# EAGLE design CoProcessor (EAGLE 9.2.2)

## Sheet 1 of 3: Connectors
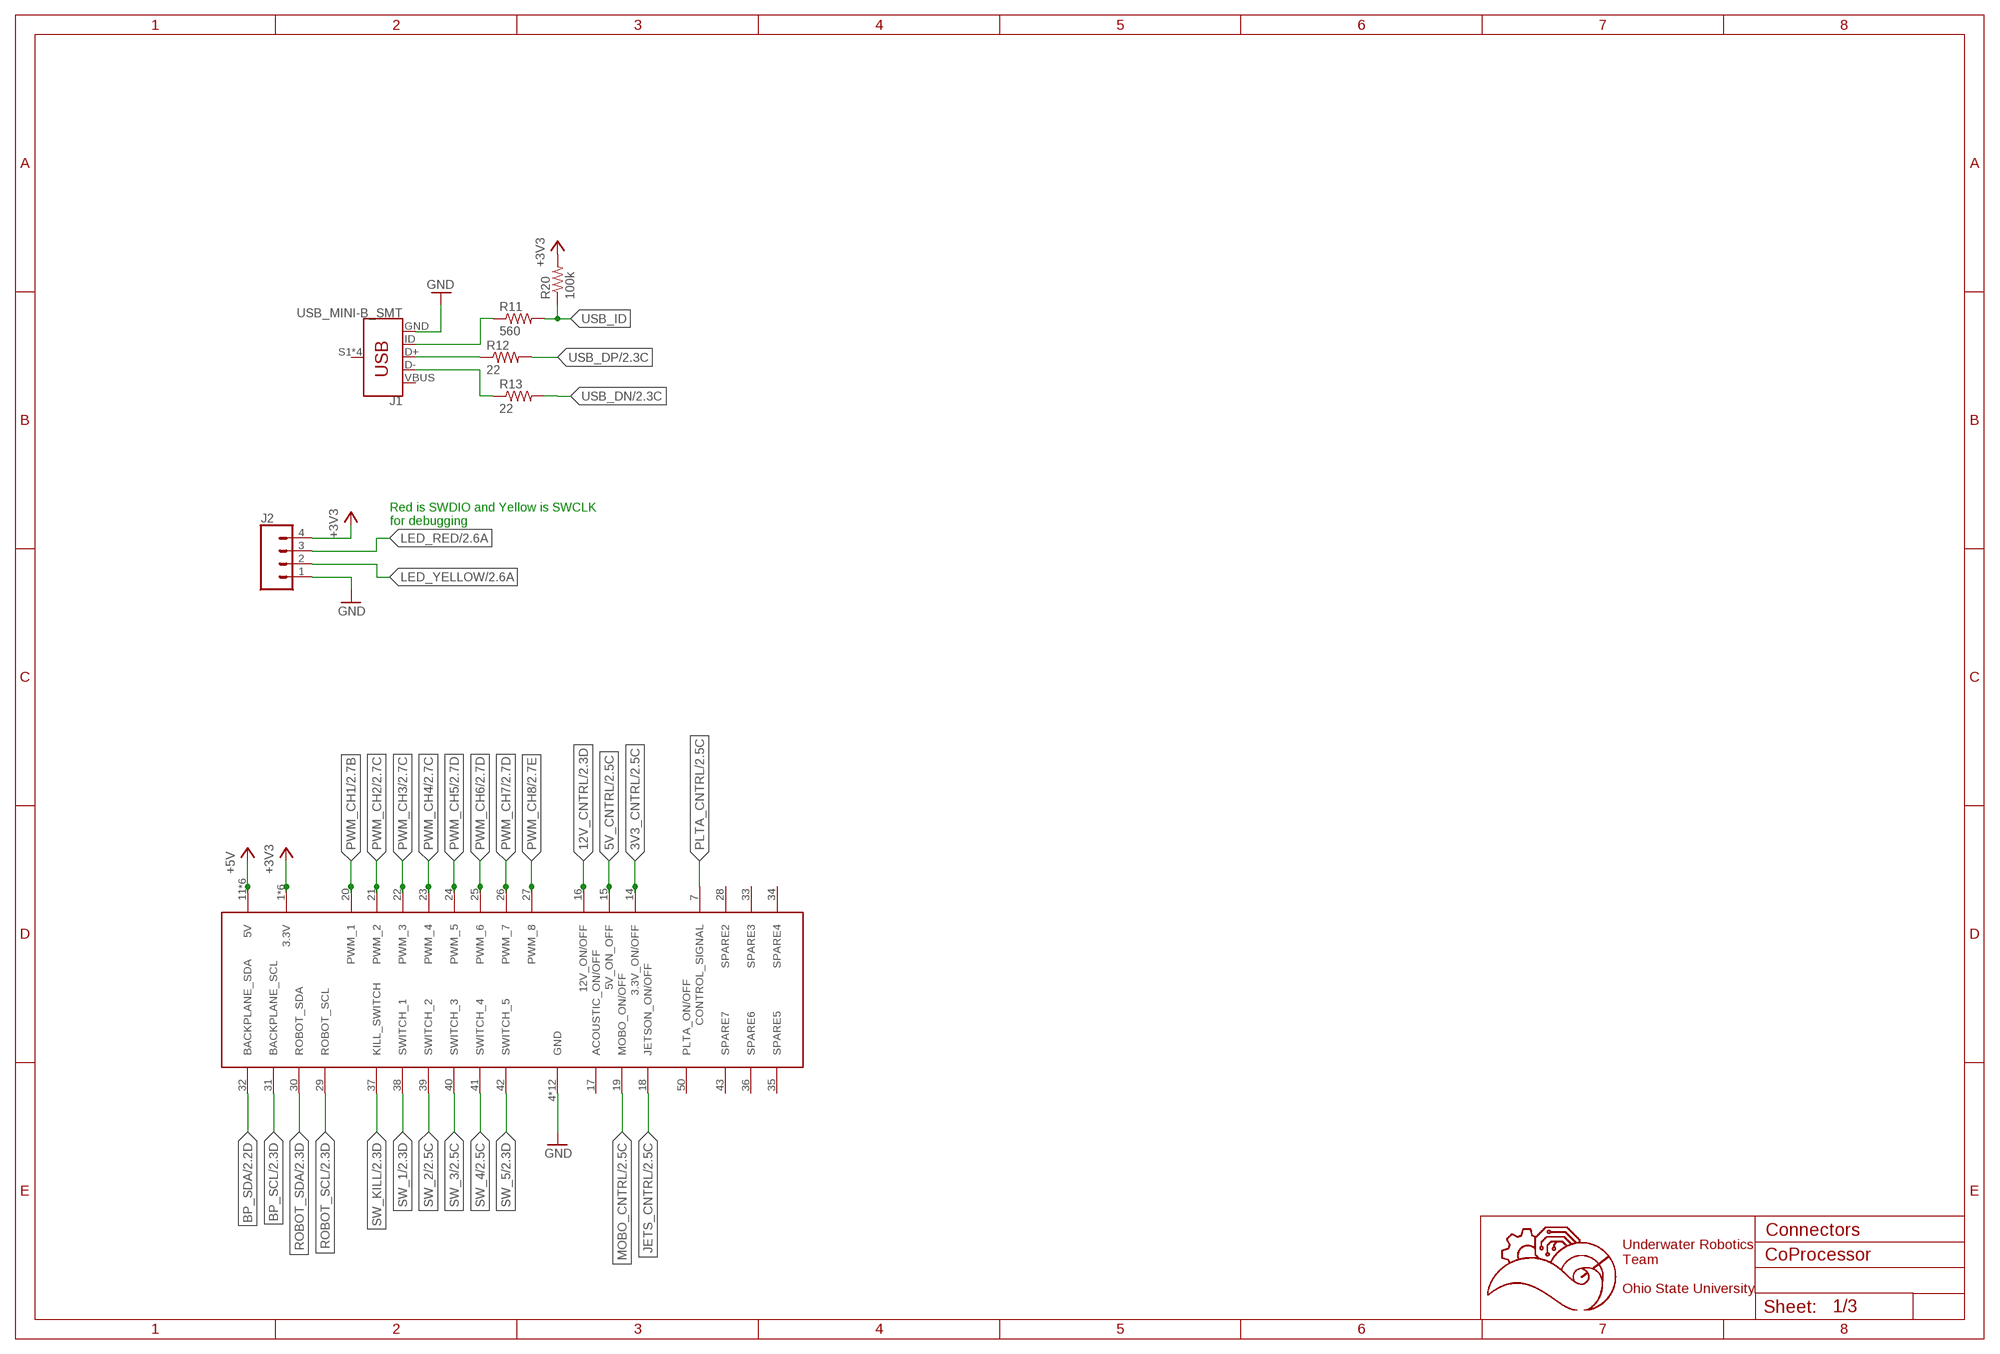
[diagram p0: schematic, sheet 1]

### Parts
J1  USB_MINI-B_SMT  [USB-MINIB]
J2  CONN_04  [1X04]
R11  560  R-US_R0603  [R0603]
R12  22  R-US_R0603  [R0603]
R13  22  R-US_R0603  [R0603]
R20  100k  R-US_R0603  [R0603]
U$1  5530843-EDGE  [5530843-6-BOARDFINGERS]

### Nets
3V3_CNTRL: U$1.14(3.3V_ON/OFF) ; also sheet 2
5V_CNTRL: U$1.15(5V_ON_OFF) ; also sheet 2
12V_CNTRL: U$1.16(12V_ON/OFF) ; also sheet 2
+3V3: J2.4 R20.2 U$1.1(3.3V) U$1.2(3.3V) U$1.3(3.3V) U$1.54(3.3V) U$1.55(3.3V) U$1.56(3.3V) ; also sheet 2,3
+5V: U$1.11(5V) U$1.12(5V) U$1.13(5V) U$1.44(5V) U$1.45(5V) U$1.46(5V)
BP_SCL: U$1.31(BACKPLANE_SCL) ; also sheet 2
BP_SDA: U$1.32(BACKPLANE_SDA) ; also sheet 2
GND: J1.GND J2.1 U$1.4(GND) U$1.5(GND) U$1.6(GND) U$1.8(GND) U$1.9(GND) U$1.10(GND) U$1.47(GND) U$1.48(GND) U$1.49(GND) U$1.51(GND) U$1.52(GND) U$1.53(GND) ; also sheet 2,3
JETS_CNTRL: U$1.18(JETSON_ON/OFF) ; also sheet 2
LED_RED: J2.3 ; also sheet 2
LED_YELLOW: J2.2 ; also sheet 2
MOBO_CNTRL: U$1.19(MOBO_ON/OFF) ; also sheet 2
N$2: J1.ID R11.1
N$4: J1.D+ R12.1
N$5: J1.D- R13.1
PLTA_CNTRL: U$1.7(CONTROL_SIGNAL) ; also sheet 2
PWM_CH1: U$1.20(PWM_1) ; also sheet 2
PWM_CH2: U$1.21(PWM_2) ; also sheet 2
PWM_CH3: U$1.22(PWM_3) ; also sheet 2
PWM_CH4: U$1.23(PWM_4) ; also sheet 2
PWM_CH5: U$1.24(PWM_5) ; also sheet 2
PWM_CH6: U$1.25(PWM_6) ; also sheet 2
PWM_CH7: U$1.26(PWM_7) ; also sheet 2
PWM_CH8: U$1.27(PWM_8) ; also sheet 2
ROBOT_SCL: U$1.29(ROBOT_SCL) ; also sheet 2
ROBOT_SDA: U$1.30(ROBOT_SDA) ; also sheet 2
SW_1: U$1.38(SWITCH_1) ; also sheet 2
SW_2: U$1.39(SWITCH_2) ; also sheet 2
SW_3: U$1.40(SWITCH_3) ; also sheet 2
SW_4: U$1.41(SWITCH_4) ; also sheet 2
SW_5: U$1.42(SWITCH_5) ; also sheet 2
SW_KILL: U$1.37(KILL_SWITCH) ; also sheet 2
USB_DN: R13.2 ; also sheet 2
USB_DP: R12.2 ; also sheet 2
USB_ID: R11.2 R20.1
Unconnected: J1.S1(SHIELD) J1.S2(SHIELD) J1.S3(SHIELD) J1.S4(SHIELD) U$1.17(ACOUSTIC_ON/OFF) U$1.28(SPARE2) U$1.33(SPARE3) U$1.34(SPARE4) U$1.35(SPARE5) U$1.36(SPARE6) U$1.43(SPARE7) U$1.50(PLTA_ON/OFF)

### Notes on the sheet
- Red is SWDIO and Yellow is SWCLK
  for debugging
- Connectors
- Underwater Robotics
  Team
  
  Ohio State University

## Sheet 2 of 3: MCU
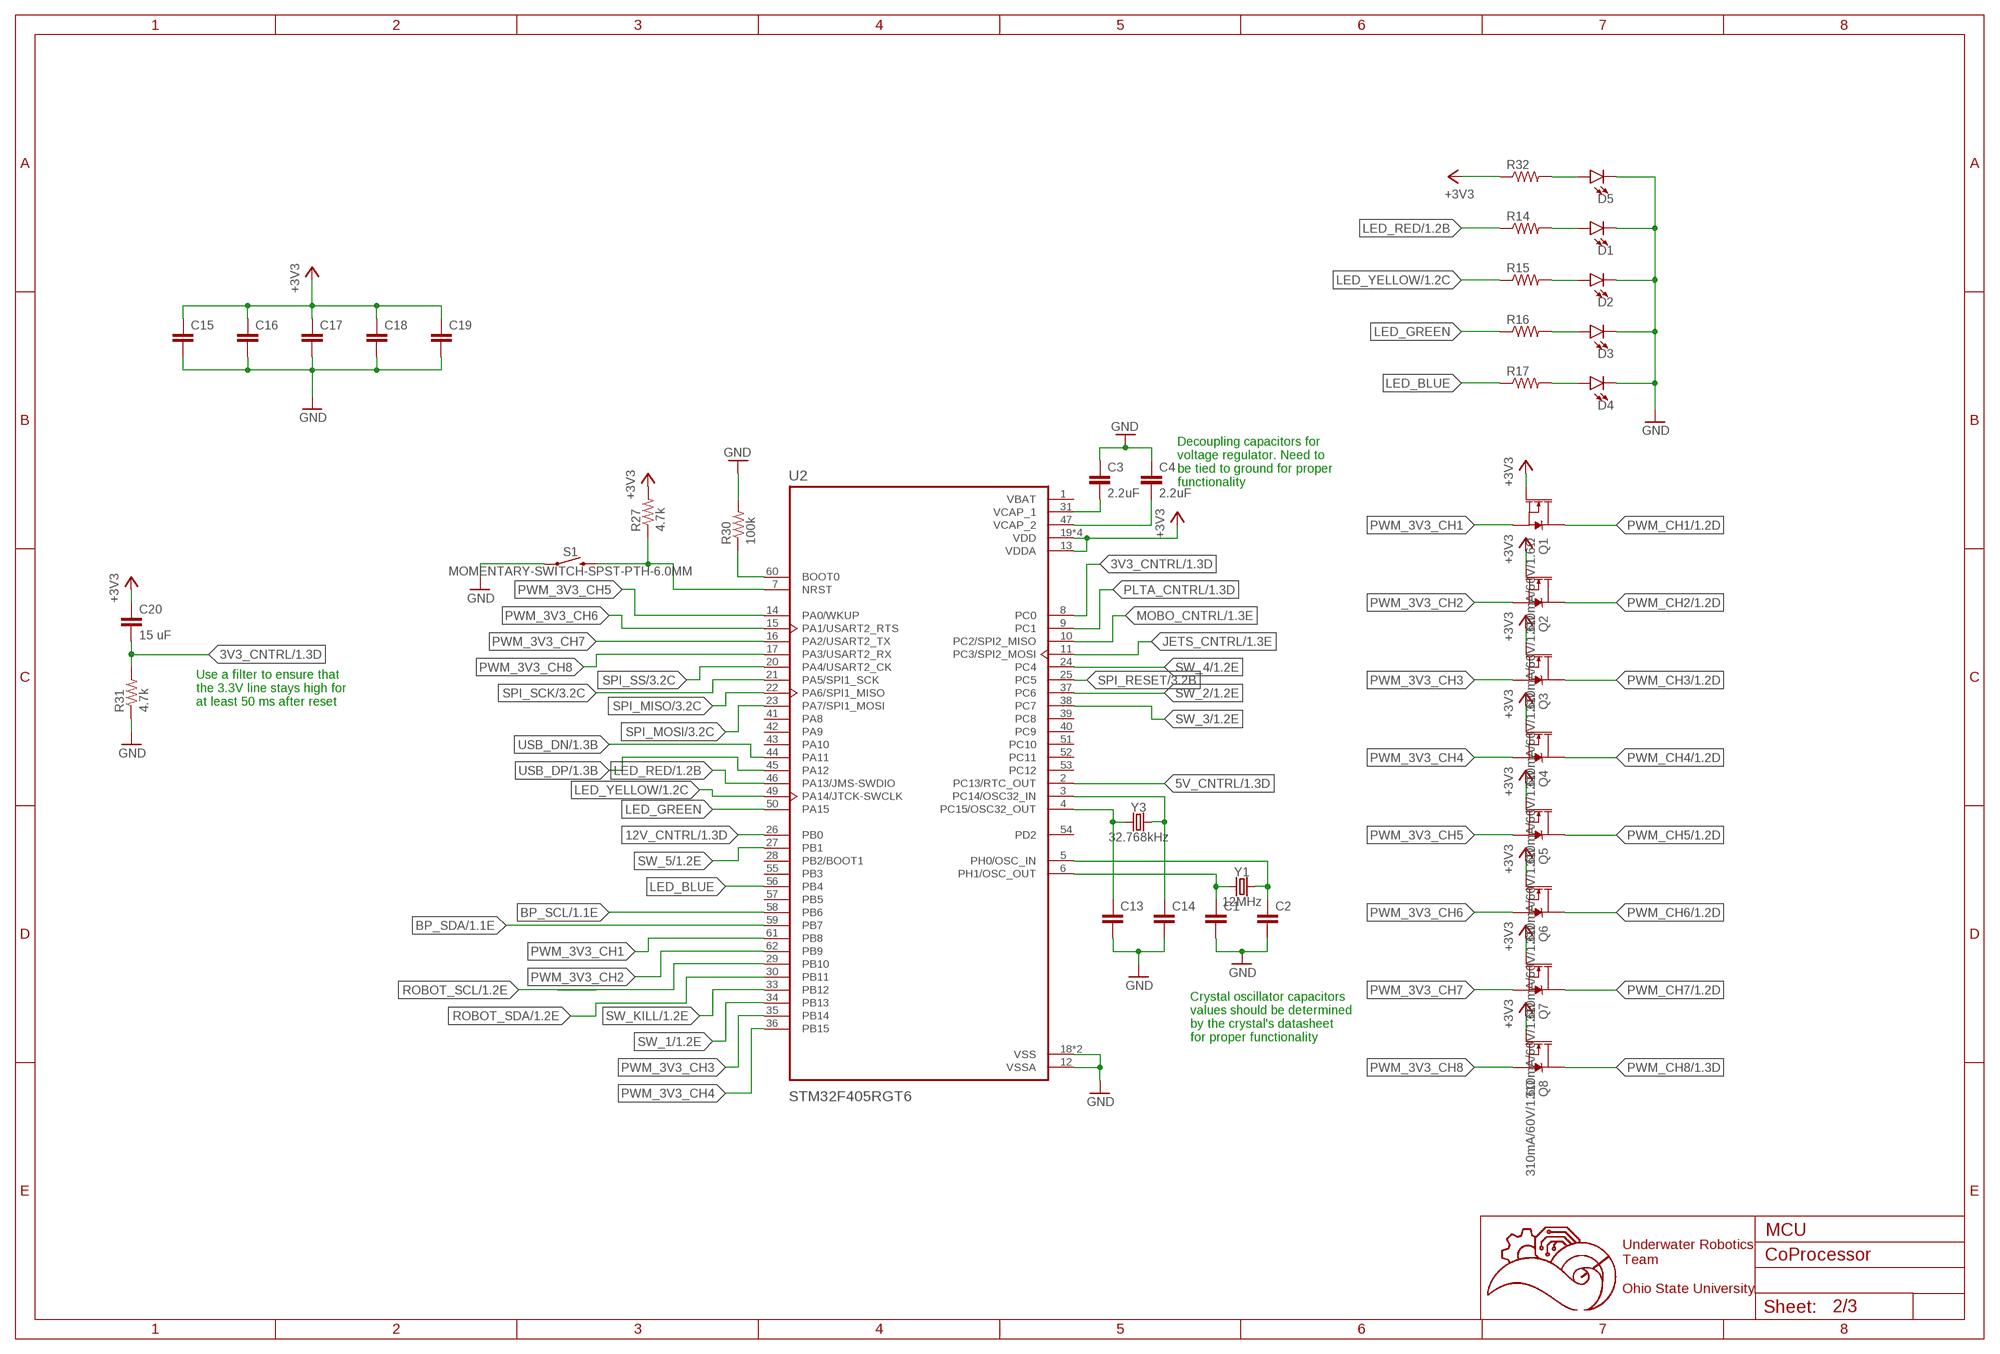
[diagram p1: schematic, sheet 2]

### Parts
C1  C-EUC0603  [C0603]
C2  C-EUC0603  [C0603]
C3  2.2uF  C-EUC0603  [C0603]
C4  2.2uF  C-EUC0603  [C0603]
C13  C-EUC0603  [C0603]
C14  C-EUC0603  [C0603]
C15  C-EUC0603  [C0603]
C16  C-EUC0603  [C0603]
C17  C-EUC0603  [C0603]
C18  C-EUC0603  [C0603]
C19  C-EUC0603  [C0603]
C20  15 uF  C-EU050-025X075  [C050-025X075]
D1  LED0603  [LED-0603]
D2  LED0603  [LED-0603]
D3  LED0603  [LED-0603]
D4  LED0603  [LED-0603]
D5  LED0603  [LED-0603]
Q1  310mA/60V/1.6Ω  MOSFET-NCH-2N7002PW  [SOT323]
Q2  310mA/60V/1.6Ω  MOSFET-NCH-2N7002PW  [SOT323]
Q3  310mA/60V/1.6Ω  MOSFET-NCH-2N7002PW  [SOT323]
Q4  310mA/60V/1.6Ω  MOSFET-NCH-2N7002PW  [SOT323]
Q5  310mA/60V/1.6Ω  MOSFET-NCH-2N7002PW  [SOT323]
Q6  310mA/60V/1.6Ω  MOSFET-NCH-2N7002PW  [SOT323]
Q7  310mA/60V/1.6Ω  MOSFET-NCH-2N7002PW  [SOT323]
Q8  310mA/60V/1.6Ω  MOSFET-NCH-2N7002PW  [SOT323]
R14  R-US_R0603  [R0603]
R15  R-US_R0603  [R0603]
R16  R-US_R0603  [R0603]
R17  R-US_R0603  [R0603]
R27  4.7k  R-US_R0603  [R0603]
R30  100k  R-US_R0603  [R0603]
R31  4.7k  R-US_R0603  [R0603]
R32  R-US_R0603  [R0603]
S1  MOMENTARY-SWITCH-SPST-PTH-6.0MM  [TACTILE_SWITCH_PTH_6.0MM]
U2  STM32F405RGT6  [QFP50P1200X1200X160-64N]
Y1  12MHz  CRYSTAL-16MHZPTH-HC49US  [HC49US]
Y3  32.768kHz  CRYSTAL-32.768KHZSMD-3.2X1.5  [CRYSTAL-SMD-3.2X1.5MM]

### Nets
3V3_CNTRL: C20.2 R31.2 U2.8(PC0) ; also sheet 1
5V_CNTRL: U2.2(PC13/RTC_OUT) ; also sheet 1
12V_CNTRL: U2.26(PB0) ; also sheet 1
+3V3: C15.1 C16.1 C17.1 C18.1 C19.1 C20.1 Q1.1(G) Q2.1(G) Q3.1(G) Q4.1(G) Q5.1(G) Q6.1(G) Q7.1(G) Q8.1(G) R27.2 R32.1 U2.13(VDDA) U2.19(VDD) U2.32(VDD) U2.48(VDD) U2.64(VDD) ; also sheet 1,3
BP_SCL: U2.58(PB6) ; also sheet 1
BP_SDA: U2.59(PB7) ; also sheet 1
GND: C1.2 C2.2 C3.1 C4.1 C13.2 C14.2 C15.2 C16.2 C17.2 C18.2 C19.2 D1.C D2.C D3.C D4.C D5.C R30.2 R31.1 S1.1 U2.12(VSSA) U2.18(VSS) U2.63(VSS) ; also sheet 1,3
JETS_CNTRL: U2.11(PC3/SPI2_MOSI) ; also sheet 1
LED_BLUE: R17.1 U2.56(PB4)
LED_GREEN: R16.1 U2.50(PA15)
LED_RED: R14.1 U2.46(PA13/JMS-SWDIO) ; also sheet 1
LED_YELLOW: R15.1 U2.49(PA14/JTCK-SWCLK) ; also sheet 1
MOBO_CNTRL: U2.10(PC2/SPI2_MISO) ; also sheet 1
N$1: C1.1 U2.6(PH1/OSC_OUT) Y1.1
N$3: D1.A R14.2
N$6: D2.A R15.2
N$7: D3.A R16.2
N$8: D4.A R17.2
N$9: C2.1 U2.5(PH0/OSC_IN) Y1.2
N$10: C4.2 U2.47(VCAP_2)
N$11: C3.2 U2.31(VCAP_1)
N$15: C13.1 U2.4(PC15/OSC32_OUT) Y3.P$1
N$29: C14.1 U2.3(PC14/OSC32_IN) Y3.P$2
N$30: R30.1 U2.60(BOOT0)
N$31: D5.A R32.2
N$34: R27.1 S1.3 U2.7(NRST)
PLTA_CNTRL: U2.9(PC1) ; also sheet 1
PWM_3V3_CH1: Q1.2(S) U2.61(PB8)
PWM_3V3_CH2: Q2.2(S) U2.62(PB9)
PWM_3V3_CH3: Q3.2(S) U2.35(PB14)
PWM_3V3_CH4: Q4.2(S) U2.36(PB15)
PWM_3V3_CH5: Q5.2(S) U2.14(PA0/WKUP)
PWM_3V3_CH6: Q6.2(S) U2.15(PA1/USART2_RTS)
PWM_3V3_CH7: Q7.2(S) U2.16(PA2/USART2_TX)
PWM_3V3_CH8: Q8.2(S) U2.17(PA3/USART2_RX)
PWM_CH1: Q1.3(D) ; also sheet 1
PWM_CH2: Q2.3(D) ; also sheet 1
PWM_CH3: Q3.3(D) ; also sheet 1
PWM_CH4: Q4.3(D) ; also sheet 1
PWM_CH5: Q5.3(D) ; also sheet 1
PWM_CH6: Q6.3(D) ; also sheet 1
PWM_CH7: Q7.3(D) ; also sheet 1
PWM_CH8: Q8.3(D) ; also sheet 1
ROBOT_SCL: U2.29(PB10) ; also sheet 1
ROBOT_SDA: U2.30(PB11) ; also sheet 1
SPI_MISO: U2.22(PA6/SPI1_MISO) ; also sheet 3
SPI_MOSI: U2.23(PA7/SPI1_MOSI) ; also sheet 3
SPI_RESET: U2.25(PC5) ; also sheet 3
SPI_SCK: U2.21(PA5/SPI1_SCK) ; also sheet 3
SPI_SS: U2.20(PA4/USART2_CK) ; also sheet 3
SW_1: U2.34(PB13) ; also sheet 1
SW_2: U2.37(PC6) ; also sheet 1
SW_3: U2.38(PC7) ; also sheet 1
SW_4: U2.24(PC4) ; also sheet 1
SW_5: U2.27(PB1) ; also sheet 1
SW_KILL: U2.33(PB12) ; also sheet 1
USB_DN: U2.44(PA11) ; also sheet 1
USB_DP: U2.45(PA12) ; also sheet 1
Unconnected: U2.28(PB2/BOOT1) U2.39(PC8) U2.40(PC9) U2.41(PA8) U2.42(PA9) U2.43(PA10) U2.51(PC10) U2.52(PC11) U2.53(PC12) U2.54(PD2) U2.55(PB3) U2.57(PB5)

### Notes on the sheet
- Decoupling capacitors for 
  voltage regulator. Need to
  be tied to ground for proper
  functionality
- Use a filter to ensure that
  the 3.3V line stays high for
  at least 50 ms after reset
- Crystal oscillator capacitors
  values should be determined
  by the crystal's datasheet
  for proper functionality
- MCU
- Underwater Robotics
  Team
  
  Ohio State University

## Sheet 3 of 3: Ethernet
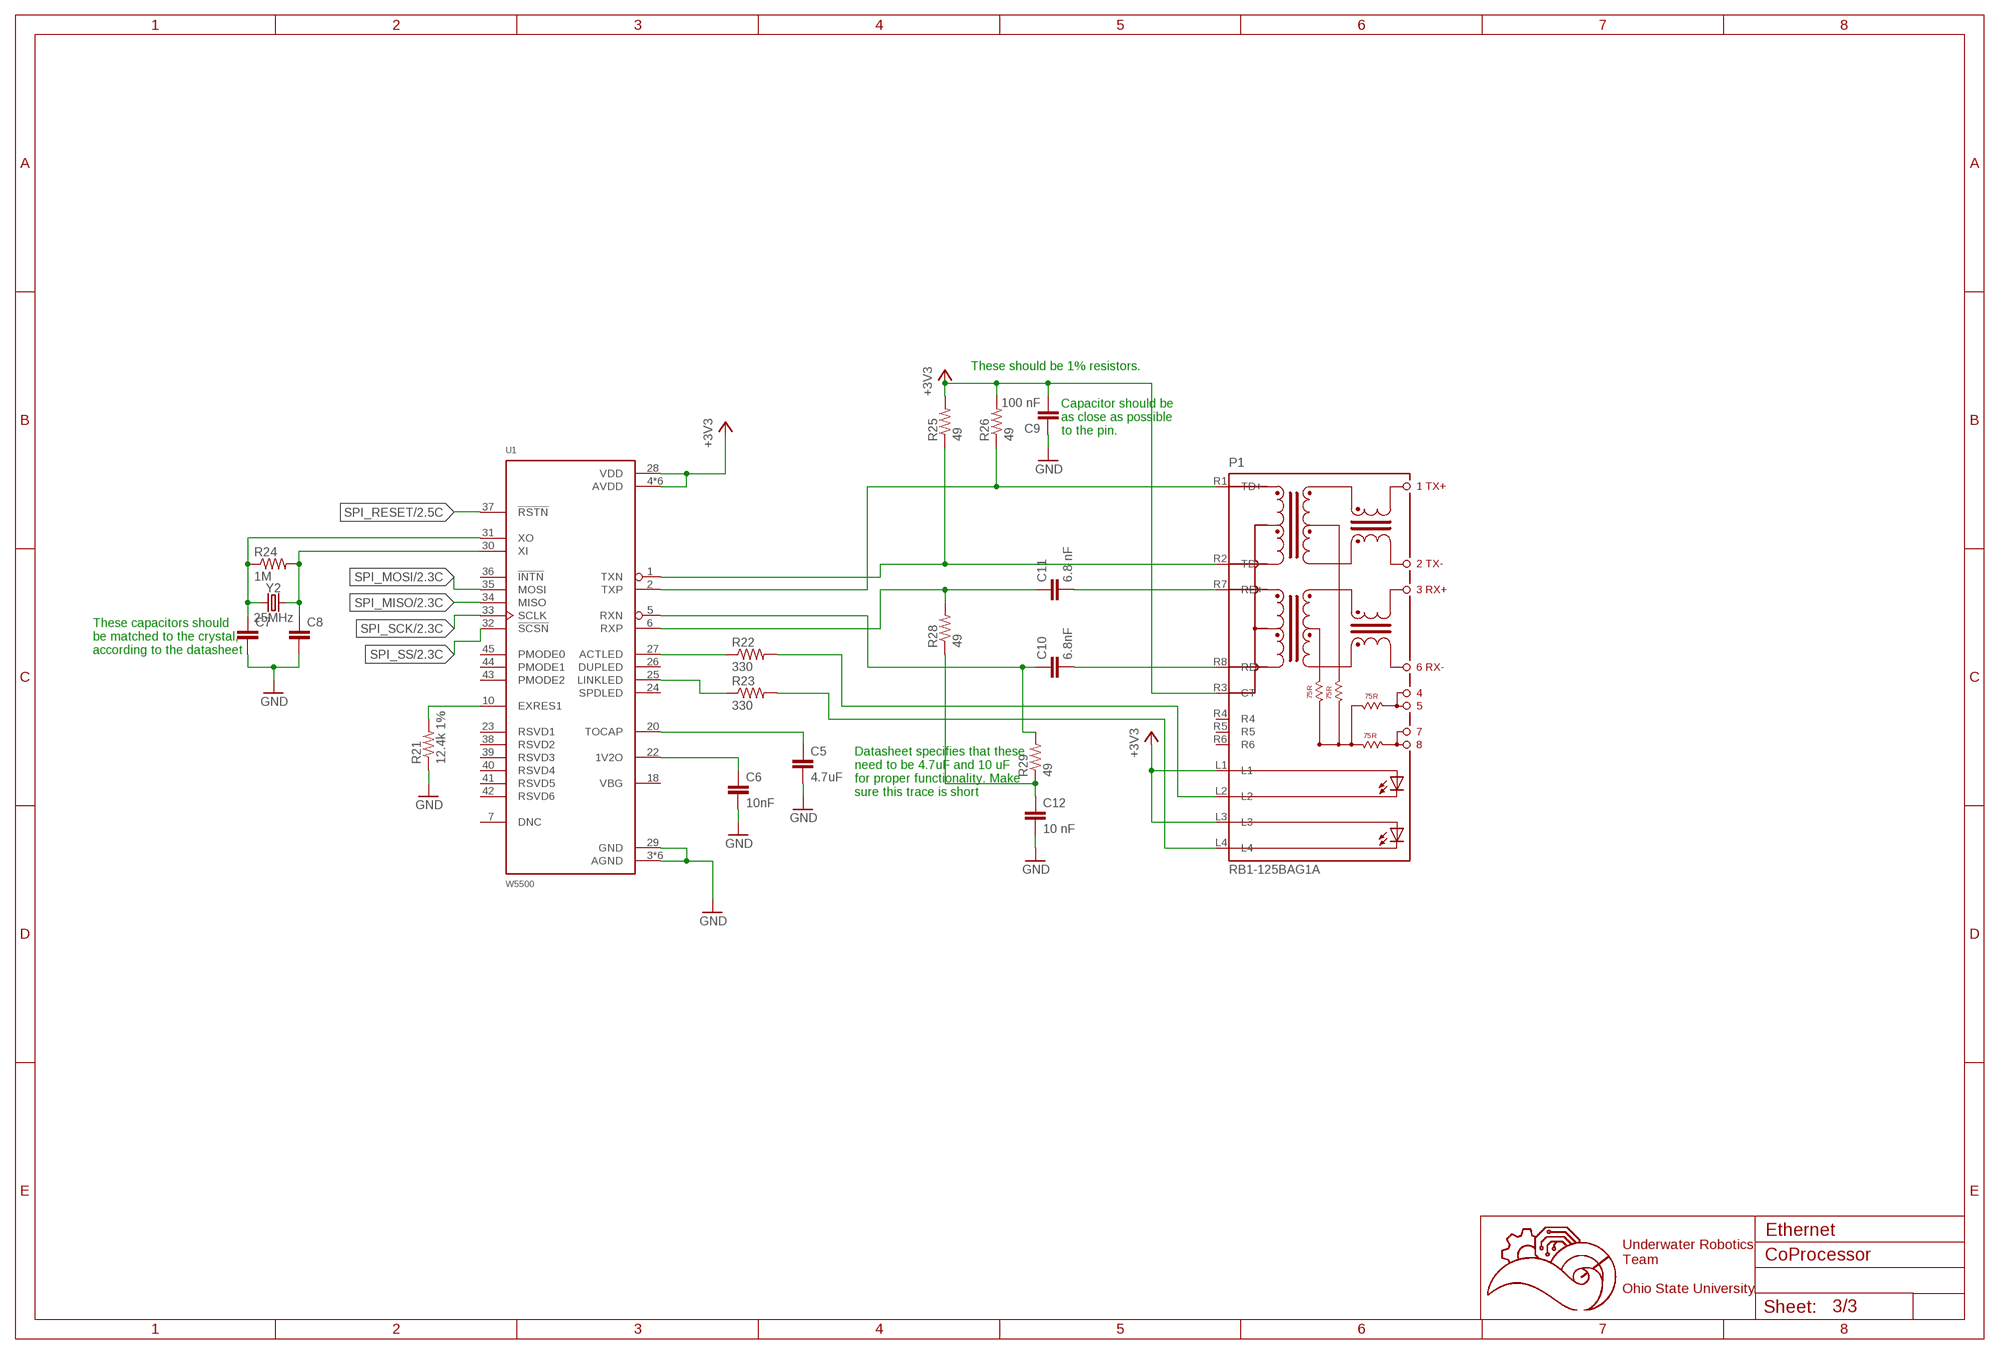
[diagram p2: schematic, sheet 3]

### Parts
C5  4.7uF  C-EUC0603  [C0603]
C6  10nF  C-EUC0603  [C0603]
C7  C-EUC0603  [C0603]
C8  C-EUC0603  [C0603]
C9  100 nF  C-EUC0603  [C0603]
C10  6.8nF  C-EUC0603  [C0603]
C11  6.8 nF  C-EUC0603  [C0603]
C12  10 nF  C-EUC0603  [C0603]
P1  RB1-125BAG1A  [WIZNET_RB1-125BAG1A]
R21  12.4k 1%  R-US_R0603  [R0603]
R22  330  R-US_R0603  [R0603]
R23  330  R-US_R0603  [R0603]
R24  1M  R-US_R0603  [R0603]
R25  49  R-US_R0603  [R0603]
R26  49  R-US_R0603  [R0603]
R28  49  R-US_R0603  [R0603]
R29  49  R-US_R0603  [R0603]
U1  W5500  [QFP50P900X900X160-48N]
Y2  25MHz  CRYSTALPTH-HC49US  [HC49US]

### Nets
+3V3: C9.2 P1.L1 P1.L3 P1.R3(CT) R25.2 R26.2 U1.4(AVDD) U1.8(AVDD) U1.11(AVDD) U1.15(AVDD) U1.17(AVDD) U1.21(AVDD) U1.28(VDD) ; also sheet 1,2
GND: C5.2 C6.2 C7.2 C8.2 C9.1 C12.2 R21.1 U1.3(AGND) U1.9(AGND) U1.14(AGND) U1.16(AGND) U1.19(AGND) U1.29(GND) U1.48(AGND) ; also sheet 1,2
N$12: C5.1 U1.20(TOCAP)
N$13: C6.1 U1.22(1V2O)
N$14: R21.2 U1.10(EXRES1)
N$16: P1.R2(TD-) R25.1 U1.1(TXN)
N$17: P1.R1(TD+) R26.1 U1.2(TXP)
N$18: C10.1 R29.2 U1.5(RXN)
N$19: C11.1 R28.2 U1.6(RXP)
N$20: P1.L2 R22.2
N$21: P1.L4 R23.2
N$22: R22.1 U1.27(ACTLED)
N$23: R23.1 U1.25(LINKLED)
N$24: C8.1 R24.2 U1.30(XI) Y2.2
N$25: C7.1 R24.1 U1.31(XO) Y2.1
N$26: C10.2 P1.R8(RD-)
N$27: C11.2 P1.R7(RD+)
N$28: C12.1 R28.1 R29.1
SPI_MISO: U1.34(MISO) ; also sheet 2
SPI_MOSI: U1.35(MOSI) ; also sheet 2
SPI_RESET: U1.37(!RSTN) ; also sheet 2
SPI_SCK: U1.33(SCLK) ; also sheet 2
SPI_SS: U1.32(!SCSN) ; also sheet 2
Unconnected: P1.R4 P1.R5 P1.R6 U1.7(DNC) U1.18(VBG) U1.23(RSVD1) U1.24(SPDLED) U1.26(DUPLED) U1.36(!INTN) U1.38(RSVD2) U1.39(RSVD3) U1.40(RSVD4) U1.41(RSVD5) U1.42(RSVD6) U1.43(PMODE2) U1.44(PMODE1) U1.45(PMODE0)

### Notes on the sheet
- These should be 1% resistors.
- Capacitor should be
  as close as possible
  to the pin.
- These capacitors should
  be matched to the crystal,
  according to the datasheet
- Datasheet specifies that these
  need to be 4.7uF and 10 uF
  for proper functionality. Make 
  sure this trace is short
- Ethernet
- Underwater Robotics
  Team
  
  Ohio State University

## Power pins joined to a net without a drawn wire
VBAT: U2.1(VBAT)
VBUS: J1.VBUS

## Library data of the parts
C1-C20 = rcl:C-EU: CAPACITOR, European symbol; SPICEPREFIX: C
D1-D5 = SparkFun-LED:LED: LED (Generic) Standard schematic elements and footprints for 5mm, 3mm, 1206, and 0603 sized LEDs. Generic LEDs with no color specified.
J1 = SparkFun-Connectors:USB_MINI-B: USB type Mini-B Connector Breaks out 5th pin, and includes shield pins if needed. SparkFun Products: SparkFun FTDI Basic Breakout <https://www.sparkfun.com/products/9716> SparkFun XBee Explorer USB <https://www.sparkfun.com/products/11812> SparkFun Redboard <https://www.sparkfun.com/products/12757>; PROD_ID: CONN-08193; SF_ID: PRT-00587
J2 = SparkFun-Connectors:CONN_04: Multi connection point. Often used as Generic Header-pin footprint for 0.1 inch spaced/style header connections On any of the 0.1 inch spaced packages, you can populate with these: Break Away Headers - Straight <https://www.sparkfun.com/products/116> (PRT-00116) Break Away Male Headers - Right Angle <https://www.sparkfun.com/products/553> (PRT-00553) Female Headers <https://www.sparkfun.com/products/115> (PRT-00115) Break Away Headers - Machine Pin <https://www.sparkfun.com/products/117> (PRT-00117) Break Away Female Headers - Swiss Machine Pin <https://www.sparkfun.com/products/743> (PRT-00743) For SCREWTERMINALS and SPRING TERMINALS visit here: Screw Terimnals on SparkFun.com <https://www.sparkfun.com/search/results?term=Screw+Terminals> (5mm/3.5mm/2.54mm spacing) This device is also useful as a general connection point to wire up your design to another part of your project. Our various solder wires solder well into these plated through hole pads. Hook-Up Wire - Assortment (Stranded, 22 AWG) <https://www.sparkfun.com/products/11375> (PRT-11375) Hook-Up Wire - Assortment (Solid Core, 22 AWG) <https://www.sparkfun.com/products/11367> (PRT-11367) View the entire wire category on our website here <https://www.sparkfun.com/categories/141> Special notes: Molex polarized connector foot print use with SKU : PRT-08231 with associated crimp pins and housings. 1MM SMD Version SKU: PRT-10208; PROD_ID: CONN-09696
P1 = RJ45-MAGJACK:RB1-125BAG1A: Accessory RJ-45 With Transformer Connector - UDE; AVAILABILITY: Unavailable; DESCRIPTION: Accessory RJ-45 With Transformer Connector - UDE; MF: WIZnet; MP: RB1-125BAG1A; PACKAGE: HVQFN-36 NXP Semiconductors; PRICE: None
Q1-Q8 = SparkFun-DiscreteSemi:MOSFET-NCH: N-channel MOSFETs Voltage controlled devices that allow control of high current outputs. SparkFun Products: SparkFun OpenScale <https://www.sparkfun.com/products/13261> SparkFun Digital Sandbox <https://www.sparkfun.com/products/12651> SparkFun Monster Moto Shield <https://www.sparkfun.com/products/10182> SparkFun MOSFET Power Controller <https://www.sparkfun.com/products/11214>; PROD_ID: TRANS-11151
R11-R17 R20-R32 = rcl:R-US_: RESISTOR, American symbol; SPICEPREFIX: R
S1 = SparkFun-Switches:MOMENTARY-SWITCH-SPST: Momentary Switch (Pushbutton) - SPST Normally-open (NO) SPST momentary switches (buttons, pushbuttons). Variants PTH-12MM - 12mm square, through-hole Momentary Pushbutton Switch - 12mm Square <https://www.sparkfun.com/products/9190> (COM-09190) PTH-6.0MM, PTH-6.0MM-KIT - 6.0mm square, through-hole Mini Pushbutton Switch <https://www.sparkfun.com/products/97> (COM-00097) KIT package intended for soldering kit's - only one side of pads' copper is exposed. PTH-RIGHT-ANGLE-KIT - Right-angle, through-hole Right Angle Tactile Button <https://www.sparkfun.com/products/10791> - Used on SparkFun BigTime Watch Kit <https://www.sparkfun.com/products/11734> SMD-12MM - 12mm square, surface-mount Tactile Button - SMD (12mm) <https://www.sparkfun.com/products/12993> (COM-12993) Used on SparkFun PicoBoard <https://www.sparkfun.com/products/11888> SMD-4.5MM - 4.5mm Square Trackball Switch Used on SparkFun Blackberry Trackballer Breakout <https://www.sparkfun.com/products/13169> SMD-4.6MMX2.8MM - 4.60mm x 2.80mm, surface mount Used on SparkFun SAMD21 Mini Breakout <https://www.sparkfun.com/products/13664> SMD-5.2MM, SMD-5.2-REDUNDANT - 5.2mm square, surface-mount Mini Pushbutton Switch - SMD <https://www.sparkfun.com/products/8720> (COM-08720) Used on Arduino Pro Mini <https://www.sparkfun.com/products/11114> REDUNDANT package connects both switch circuits together SMD-6.0X3.5MM - 6.0 x 3.5mm, surface mount Momentary Reset Switch SMD <https://www.sparkfun.com/products/8229> (COM-08229) SMD-6.2MM-TALL - 6.2mm square, surface mount Tactile Button - SMD (6mm) <https://www.sparkfun.com/products/12992> Used on SparkFun Digital Sandbox <https://www.sparkfun.com/products/12651> SMD-RIGHT-ANGLE - Right-angle, surface mount Used on SparkFun Block for Intel® Edison - Arduino <https://www.sparkfun.com/products/13036>; PROD_ID: SWCH-08441; SF_SKU: COM-00097
U1 = W5500:W5500: Hardwired TCP/IP embedded Ethernet controller; AVAILABILITY: Unavailable; DESCRIPTION: Victor Pure White Collection Wood Tidy Tower Organizer; MF: WIZnet; MP: W5500; PACKAGE: LQFP-48 Victor Technologies; PRICE: None
U2 = STM32F405RGT6:STM32F405RGT6: High-performance foundation line, ARM Cortex-M4 core with DSP and FPU, 1 Mbyte Flash, 168 MHz CPU, ART Accelerator; AVAILABILITY: Unavailable; DESCRIPTION: High-performance foundation line, ARM Cortex-M4 core with DSP and FPU, 1 Mbyte Flash, 168 MHz CPU, ART Accelerator; MF: STMicroelectronics; MP: STM32F405RGT6; PACKAGE: LQFP-64 STMicroelectronics; PRICE: None
U$1 = 5530843-6:5530843-EDGE
Y1 = SparkFun-Clocks:CRYSTAL-16MHZ: 16MHz Crystal Digikey Example <http://www.digikey.com/product-search/en?keywords=535-9122-1-ND> Frequency: 16MHz Frequency Stability: ±50ppm Frequency Tolerance: ±20ppm Load Capacitance: 18pF SparkFun Products: Pro Micro -5V/16MHz <https://www.sparkfun.com/products/12640> SparkFun Serial Enabled LCD Kit <https://www.sparkfun.com/products/10097>; PROD_ID: XTAL-08181; SF_ID: COM-00536; VALUE: 16MHz
Y2 = SparkFun-Clocks:CRYSTAL: Crystals (Generic) These are passive quartz crystals, which can be used as a clock source for a microcontroller. Crystal's are two-terminal devices. They require external "load" capacitors to generate an oscillating signal.
Y3 = SparkFun-Clocks:CRYSTAL-32.768KHZ: 32.768kHz Crystal Frequency: 32.768kHz Frequency Stability: ±20ppm Load Capacitance: 12.5pF (PTH-2X6 & SMD-3.2X1.5), 6pF (SMD-2X6) SparkFun Products: SparkFun BigTime Watch Kit <https://www.sparkfun.com/products/11734> SparkFun nRF52832 Breakout <https://www.sparkfun.com/products/13990> SparkFun Real Time Clock Module <https://www.sparkfun.com/products/12708>; PROD_ID: XTAL-13062

## Board
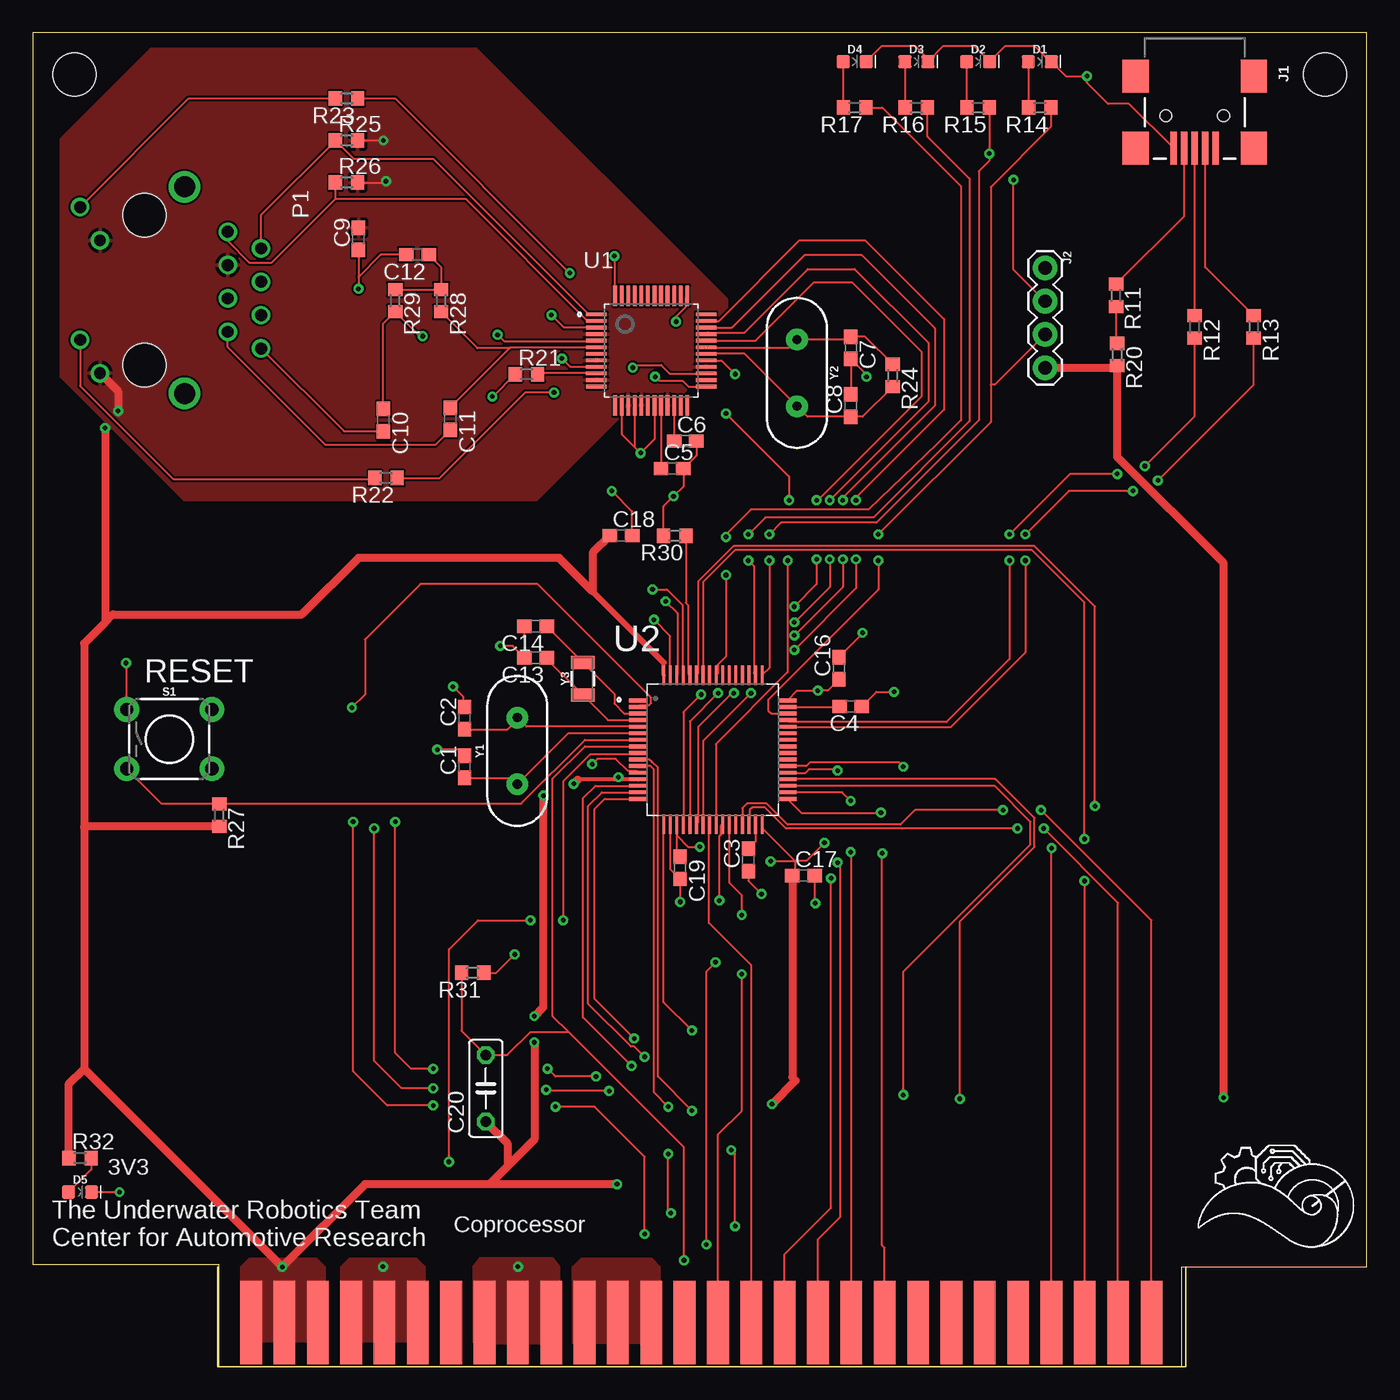
[diagram p3: board, top side]
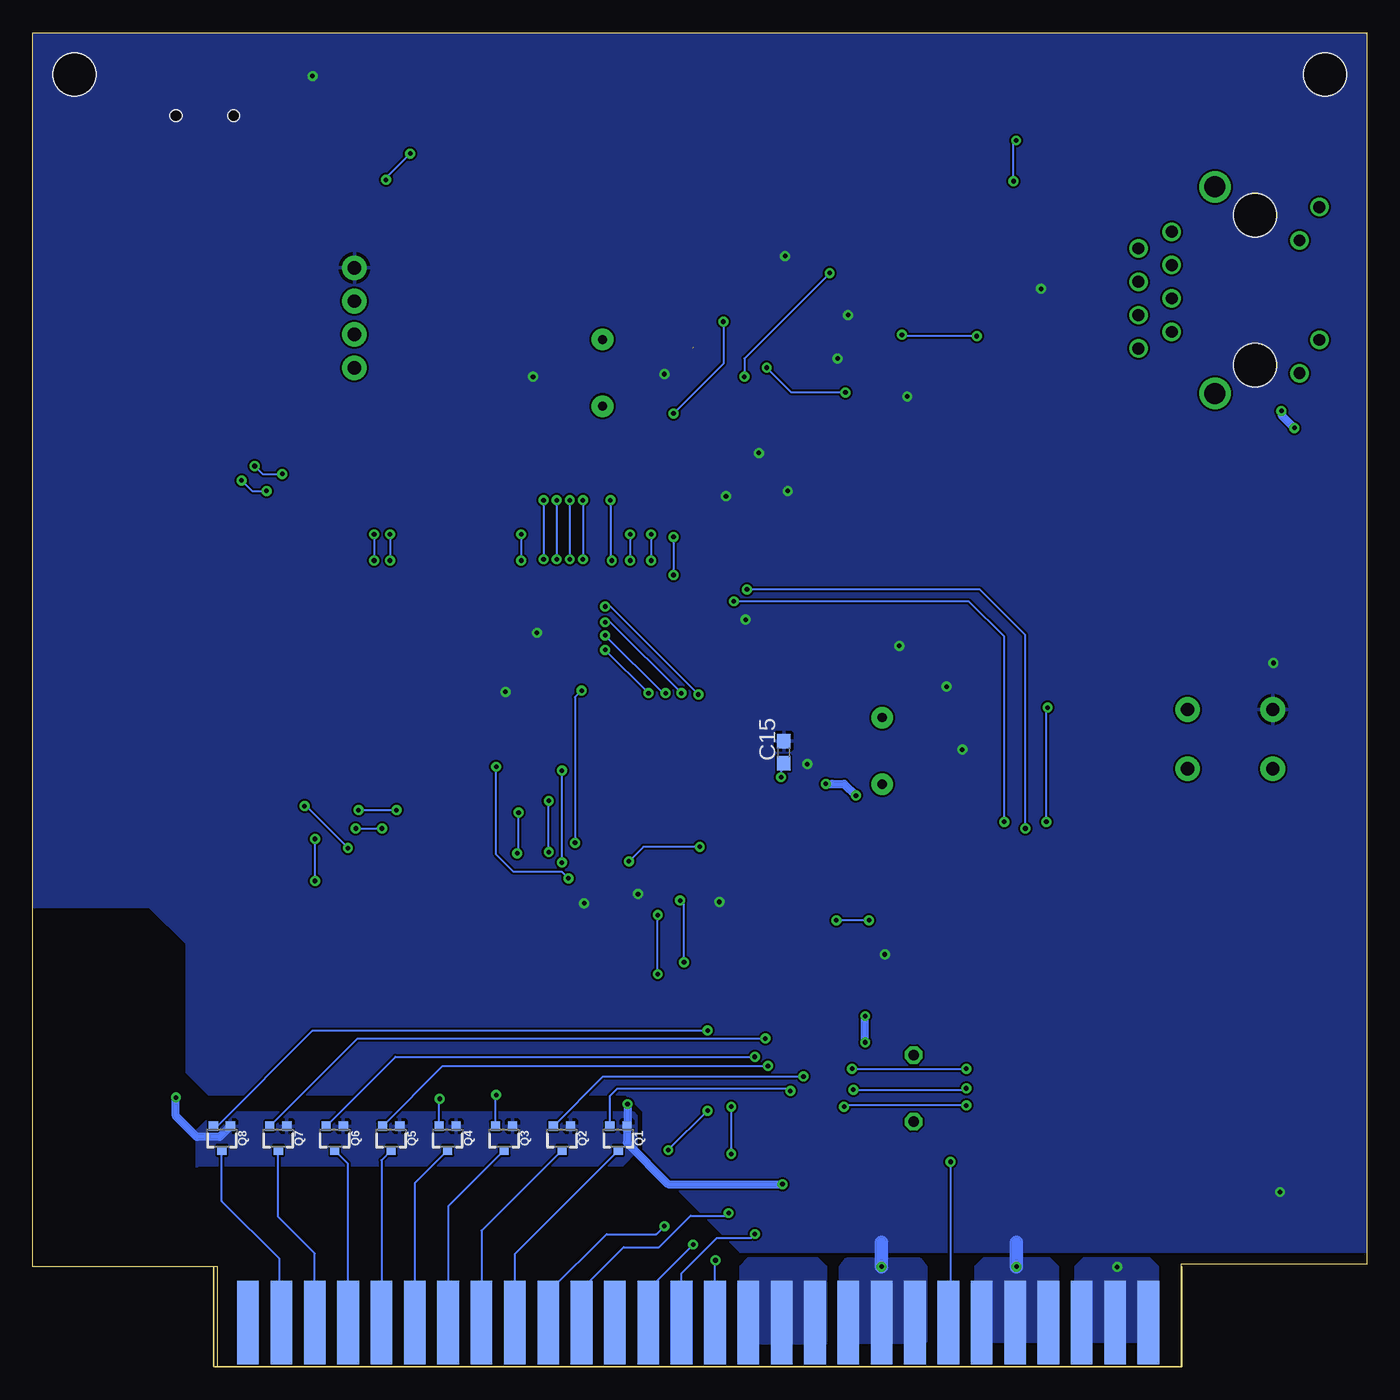
[diagram p4: board, bottom side, seen from below]

Size 101.6 x 101.6 mm. Coordinates in mm from the lower left corner, seen from the top.
Outline: 0,7.8 14.14,7.8 14.14,0 87.53,0 87.53,7.62 101.6,7.62 101.6,101.6 0,101.6 0,7.8
Copper layers (1*16): Top 0.035mm / dielectric 1.5mm / Bottom 0.035mm
Design rules "default *": minimum track width 6mil, minimum drill 0.35mm, track to track 6mil, track to pad 6mil, pad to pad 6mil, via to via 6mil, smd to smd 6mil, copper to edge 0.00508125mm, drill to drill 6mil, minimum pad ring 10mil, minimum via ring 8mil, stop-mask expansion 4mil, vias tented up to drill 0mil, thermal gap 10mil
Holes 3.26 mm at 3.17,98.42 98.42,98.42

### Footprints (pad centres in the part's own frame; a part is rotated, then mirrored left to right if it is on the bottom)
C0603 = smd 1.1 x 1: 1 -0.85,0; 2 0.85,0
C050-025X075 = drill 0.813 octagon: 1 -2.54,0; 2 2.54,0
LED-0603 = smd 1 x 1: A -0.877,0; C 0.877,0
USB-MINIB = smd 2.5 x 0.5: D+ 2.5,0; D- 2.5,0.8; GND 2.5,-1.6; ID 2.5,-0.8; VBUS 2.5,1.6 | smd 2.5 x 2: S1 -3,4.5; S2 2.5,4.5; S3 -3,-4.5; S4 2.5,-4.5 | hole 0.9: 0,2.2; 0,-2.2
1X04 = drill 1.016 pad 1.88: 1 0,0; 2 2.54,0; 3 5.08,0; 4 7.62,0
WIZNET_RB1-125BAG1A = drill 0.9: L1 6.325,-3.38; L2 3.784,-4.899; L3 -3.786,-3.379; L4 -6.325,-4.9 | drill 0.9 pad 1.3: R1 -4.446,6.349; R2 -3.176,8.889; R3 -1.906,6.349; R4 -0.636,8.889; R5 0.634,6.349; R6 1.904,8.889; R7 3.174,6.349; R8 4.444,8.889 | drill 1.6 pad 2.184: S1 -7.876,3.049; S2 7.874,3.049 | hole 3.3: 5.714,-0.001; -5.716,-0.001
SOT323 = smd 0.7 x 0.7: 1 -0.65,-0.925; 2 0.65,-0.925; 3 0,0.925
R0603 = smd 1 x 1.1: 1 -0.85,0; 2 0.85,0
TACTILE_SWITCH_PTH_6.0MM = drill 1.016 pad 1.88: 1 -3.251,2.261; 2 3.251,2.261; 3 -3.251,-2.261; 4 3.251,-2.261
QFP50P900X900X160-48N = smd 1.56 x 0.28: 1 -4.18,2.75; 2 -4.18,2.25; 3 -4.18,1.75; 4 -4.18,1.25; 5 -4.18,0.75; 6 -4.18,0.25; 7 -4.18,-0.25; 8 -4.18,-0.75; 9 -4.18,-1.25; 10 -4.18,-1.75; 11 -4.18,-2.25; 12 -4.18,-2.75; 25 4.18,-2.75; 26 4.18,-2.25; 27 4.18,-1.75; 28 4.18,-1.25; 29 4.18,-0.75; 30 4.18,-0.25; 31 4.18,0.25; 32 4.18,0.75; 33 4.18,1.25; 34 4.18,1.75; 35 4.18,2.25; 36 4.18,2.75 | smd 0.28 x 1.56: 13 -2.75,-4.18; 14 -2.25,-4.18; 15 -1.75,-4.18; 16 -1.25,-4.18; 17 -0.75,-4.18; 18 -0.25,-4.18; 19 0.25,-4.18; 20 0.75,-4.18; 21 1.25,-4.18; 22 1.75,-4.18; 23 2.25,-4.18; 24 2.75,-4.18; 37 2.75,4.18; 38 2.25,4.18; 39 1.75,4.18; 40 1.25,4.18; 41 0.75,4.18; 42 0.25,4.18; 43 -0.25,4.18; 44 -0.75,4.18; 45 -1.25,4.18; 46 -1.75,4.18; 47 -2.25,4.18; 48 -2.75,4.18
QFP50P1200X1200X160-64N = smd 1.47 x 0.28: 1 -5.67,3.75; 2 -5.67,3.25; 3 -5.67,2.75; 4 -5.67,2.25; 5 -5.67,1.75; 6 -5.67,1.25; 7 -5.67,0.75; 8 -5.67,0.25; 9 -5.67,-0.25; 10 -5.67,-0.75; 11 -5.67,-1.25; 12 -5.67,-1.75; 13 -5.67,-2.25; 14 -5.67,-2.75; 15 -5.67,-3.25; 16 -5.67,-3.75; 33 5.67,-3.75; 34 5.67,-3.25; 35 5.67,-2.75; 36 5.67,-2.25; 37 5.67,-1.75; 38 5.67,-1.25; 39 5.67,-0.75; 40 5.67,-0.25; 41 5.67,0.25; 42 5.67,0.75; 43 5.67,1.25; 44 5.67,1.75; 45 5.67,2.25; 46 5.67,2.75; 47 5.67,3.25; 48 5.67,3.75 | smd 0.28 x 1.47: 17 -3.75,-5.67; 18 -3.25,-5.67; 19 -2.75,-5.67; 20 -2.25,-5.67; 21 -1.75,-5.67; 22 -1.25,-5.67; 23 -0.75,-5.67; 24 -0.25,-5.67; 25 0.25,-5.67; 26 0.75,-5.67; 27 1.25,-5.67; 28 1.75,-5.67; 29 2.25,-5.67; 30 2.75,-5.67; 31 3.25,-5.67; 32 3.75,-5.67; 49 3.75,5.67; 50 3.25,5.67; 51 2.75,5.67; 52 2.25,5.67; 53 1.75,5.67; 54 1.25,5.67; 55 0.75,5.67; 56 0.25,5.67; 57 -0.25,5.67; 58 -0.75,5.67; 59 -1.25,5.67; 60 -1.75,5.67; 61 -2.25,5.67; 62 -2.75,5.67; 63 -3.25,5.67; 64 -3.75,5.67
5530843-6-BOARDFINGERS = smd 1.651 x 6.35 bottom: 1 0.826,3.375; 2 3.365,3.375; 3 5.905,3.375; 4 8.445,3.375; 5 10.986,3.375; 6 13.525,3.375; 7 16.066,3.375; 8 18.605,3.375; 9 21.145,3.375; 10 23.686,3.375; 11 26.226,3.375; 12 28.765,3.375; 13 31.305,3.375; 14 33.846,3.375; 15 36.386,3.375; 16 38.925,3.375; 17 41.465,3.375; 18 44.005,3.375; 19 46.545,3.375; 20 49.086,3.375; 21 51.626,3.375; 22 54.166,3.375; 23 56.706,3.375; 24 59.245,3.375; 25 61.785,3.375; 26 64.326,3.375; 27 66.865,3.375; 28 69.406,3.375 | smd 1.651 x 6.35: 29 69.406,3.375; 30 66.865,3.375; 31 64.326,3.375; 32 61.785,3.375; 33 59.245,3.375; 34 56.706,3.375; 35 54.166,3.375; 36 51.626,3.375; 37 49.086,3.375; 38 46.545,3.375; 39 44.005,3.375; 40 41.465,3.375; 41 38.925,3.375; 42 36.386,3.375; 43 33.846,3.375; 44 31.305,3.375; 45 28.765,3.375; 46 26.226,3.375; 47 23.686,3.375; 48 21.145,3.375; 49 18.605,3.375; 50 16.066,3.375; 51 13.525,3.375; 52 10.986,3.375; 53 8.445,3.375; 54 5.905,3.375; 55 3.365,3.375; 56 0.826,3.375
HC49US = drill 0.7 pad 1.651: 1 -2.54,0; 2 2.54,0
CRYSTAL-SMD-3.2X1.5MM = smd 1 x 1.8: P$1 -1.25,0; P$2 1.25,0

### Placement (x,y rotation side)
C1  18pF  [C0603]  32.9,45.7 90 top
C2  18pF  [C0603]  32.9,49.4 90 top
C3  54.5,38.6 90 top
C4  62.3,50.3 180 top
C5  48.7,68.4 0 top
C6  49.7,70.5 0 top
C7  18pF  [C0603]  62.3,77.6 270 top
C8  18pF  [C0603]  62.3,73.2 90 top
C9  0.1uF  [C0603]  24.8,85.9 90 top
C10  26.7,72.1 270 top
C11  31.8,72.2 270 top
C12  29.3,84.7 180 top
C13  12.5pF  [C0603]  38.3,54 180 top
C14  12.5pF  [C0603]  38.3,56.4 180 top
C15  0.1uF  [C0603]  44.4,46.8 90 bottom
C16  0.1uF  [C0603]  61.4,53.2 90 top
C17  0.1uF  [C0603]  58.7,37.4 0 top
C18  0.1uF  [C0603]  44.8,63.3 0 top
C19  0.1uF  [C0603]  49.3,38 270 top
C20  34.5,21.2 90 top
D1  76.7,99.4 0 top
D2  72,99.4 0 top
D3  67.3,99.4 0 top
D4  62.6,99.4 0 top
D5  3.6,13.3 0 top
J1  88.5,95.3 270 top
J2  77.1,83.7 270 top
P1  8.5,82 270 top
Q1  57,17.4 180 bottom
Q2  61.3,17.4 180 bottom
Q3  65.7,17.4 180 bottom
Q4  70,17.4 180 bottom
Q5  74.3,17.4 180 bottom
Q6  78.6,17.4 180 bottom
Q7  82.9,17.4 180 bottom
Q8  87.2,17.4 180 bottom
R11  82.5,81.6 270 top
R12  88.5,79.2 270 top
R13  93,79.2 270 top
R14  65  [R0603]  76.7,95.9 180 top
R15  65  [R0603]  72,95.9 180 top
R16  5  [R0603]  67.3,95.9 180 top
R17  5  [R0603]  62.6,95.9 180 top
R20  82.6,77.1 270 top
R21  37.6,75.6 0 top
R22  26.9,67.7 180 top
R23  23.9,96.6 180 top
R24  65.5,75.5 270 top
R25  23.9,93.4 0 top
R26  23.9,90.2 0 top
R27  14.2,42 270 top
R28  31.1,81.2 270 top
R29  27.6,81.2 270 top
R30  48.9,63.3 180 top
R31  33.5,30 180 top
R32  5  [R0603]  3.6,15.9 0 top
S1  10.4,47.8 0 top
U1  47.1,77.4 0 top
U2  51.8,47 0 top
U$1  15.8,0 0 top
Y1  36.9,46.9 90 top
Y2  58.2,75.7 270 top
Y3  41.9,52.4 90 top

### Tracks (layer width: path | path; a pad name or v marks a point on that pad's centre or on a via)
3V3_CNTRL  (via drill 0.35)
  Top 0.152: v49.6,8.1 49.6,16.7 40.85,25.45 40.8,25.5 | U2.8 42.05,47.25 39.6,44.8 39.6,26.7 40.8,25.5 | R31.2 32.65,25.59 C20.2 36.14,23.74 37.9,25.5 40.8,25.5
  Bottom 0.152: U$1.14 49.65,8.05 v49.6,8.1
5V_CNTRL  (via drill 0.35)
  Top 0.152: v46.6,10.1 46.6,16 42.8,19.8 v39.8,19.8 | v24.3,50.2 25.3,51.2 25.3,55.4 29.53,59.63 38.43,59.63 47.09,50.96 47.09,50.54 46.94,50.38 46.26,50.38 U2.2 46.08,50.2 | v24.4,41.5 24.4,22.5 27,19.9 v30.5,19.9
  Bottom 0.152: 52.19,4.51 U$1.15 52.19,7.11 49.5,9.8 46.9,9.8 v46.6,10.1 | v24.4,41.5 24.4,50.1 v24.3,50.2 | v30.5,19.9 39.7,19.9 v39.8,19.8
12V_CNTRL  (via drill 0.35)
  Top 0.152: v51.3,9.3 51.3,30.1 v52,30.8 | v52.3,35.5 52.3,40.4 52.42,40.52 52.42,41.2 U2.26
  Bottom 0.152: U$1.16 54.73,5.88 v51.3,9.3 | v52,30.8 52,35.2 v52.3,35.5
+3V3  (via drill 0.35)
  Top 0.152: U2.13 46.1,44.72 44.88,44.72 44.7,44.9 v44.6,44.9 | U2.48 58.22,51.5 v59.8,51.5 60.55,51.5 C16.1 | 38.55,43.5 v38.9,43.5 | 3.95,41.15 3.9,41.1 | R26.2 26.8,90.2 v26.9,90.3 | v26.7,93.4 R25.2 | 82.43,76.08 R20.2 | 58.05,38.53 57.85,38.73 55.55,41.03 U2.32 | v60.3,39.9 58.93,38.53 58.05,38.53 | 58.05,38.53 58.02,38.5 v56.2,38.5 | 57.85,22.05 58.1,21.8 | 58.05,38.53 58.05,37.6 C17.1 | 20.5,57.3 20.6,57.4 | v50.8,39.6 49.9,39.6 49.05,40.45 U2.19 49.05,39.1 C19.1
  Top 0.305: 46.1,44.72 41.52,44.72 | U2.64 48.05,53.65
  Top 0.508: 48.05,53.65 42.65,59.05
  Top 0.61: v44.5,13.9 34.8,13.9 | 34.8,13.9 25.3,13.9 v19,7.6 3.9,22.7 | v38.2,24.7 38.2,17.3 36.15,15.25 | 36.15,15.25 34.8,13.9 | 58.1,21.8 v56.3,20 | P1.L1 6.5,74.3 v6.5,72.8 | v5.5,71.5 5.5,56.7 | 3.9,22.7 3.9,41.1 3.9,55.1 5.5,56.7 | 20.6,57.4 24.8,61.6 40.1,61.6 42.65,59.05 42.65,62 C18.1 | 5.5,56.7 6.1,57.3 20.5,57.3 | R27.2 3.95,41.15 | C20.1 36.15,17.01 36.15,15.25 | R32.1 2.75,21.55 3.9,22.7 | J2.4 82.43,76.08 | C17.1 57.85,22.05 | v38.9,43.5 38.9,27.4 v38.2,26.7 | 41.52,44.72 v41.2,44.4 | v90.7,20.5 90.7,61.2 82.6,69.3 R20.2
  Bottom 0.152: 60.65,18.15 Q2.1 | 56.3,18.38 Q1.1 | v59.8,51.5 60.3,51 v60.3,39.9 | v50.8,39.6 54.4,39.6 55.1,39.6 v56.2,38.5 | v26.9,90.3 26.9,93.2 v26.7,93.4 | v44.6,44.9 44.6,45.75 C15.1
  Bottom 0.61: Q1.1 56.35,17.05 53.2,13.9 v44.5,13.9 | v41.2,44.4 40.7,44.4 39.8,44.4 v38.9,43.5 | v56.3,20 56.3,18.38 | v6.5,72.8 6.5,72.5 v5.5,71.5 | v38.2,24.7 v38.2,26.7 | Q8.1 87.38,17.5 89.1,17.5 90.7,19.1 v90.7,20.5
  pour Bottom (no thermals): 15.88,7.62 16.51,8.26 21.59,8.26 22.23,7.62 22.23,1.91 15.88,1.91
  pour Top (no thermals): 15.88,7.62 16.51,8.26 21.59,8.26 22.23,7.62 22.23,1.91 15.88,1.91
  pour Bottom: 55.6,19.1 55.6,16.4 56.7,15.3 89,15.3 89.1,15.2 89.1,18 87.7,19.4 55.9,19.4
  pour Top: 8.9,100.3 2.1,93.5 2.1,75.4 11.5,66 38.4,66 45.6,73.2 48.6,73.2 52.9,77.5 52.9,81.3 33.8,100.4 9,100.4
+5V
  pour Top (no thermals): 41.15,1.78 41.15,7.62 41.78,8.26 47.12,8.26 47.75,7.62 47.75,1.78
  pour Bottom (no thermals): 41.15,1.78 41.15,7.62 41.78,8.26 47.12,8.26 47.75,7.62 47.75,1.78
BP_SCL  (via drill 0.35)
  Top 0.152: U2.58 51.05,59.75 53.5,62.2 76.1,62.2 80.1,58.2 v80.1,40.2 | U$1.31 80.13,36.97 v80.1,37
  Bottom 0.152: v80.1,37 v80.1,40.2
BP_SDA  (via drill 0.35)
  Top 0.152: U2.59 50.68,52.8 50.68,59.81 53.37,62.51 76.3,62.51 80.9,57.91 v80.9,42.7 | U$1.32 77.58,39.49 v77.6,39.5
  Bottom 0.152: v77.6,39.5 80.8,42.7 v80.9,42.7
GND  (via drill 0.35)
  Top 0.152: D4.C 64.68,100.6 67.2,100.6 68.18,99.62 D3.C 69.38,100.6 71.7,100.6 72.88,99.42 D2.C 74.08,100.6 76.3,100.6 77.5,99.4 D1.C 78.68,98.3 v80.3,98.3 80.3,97.8 81.9,96.2 83.5,96.2 J1.GND | U1.29 52.45,76.65 v53.5,75.6 | R21.1 35.05,73.9 v35,73.9 | U1.9 40.95,76.15 v40.3,76.8 | U1.3 40.45,79.15 v39.5,80.1 | U1.48 44.35,84.55 v44.3,84.6 | C9.1 24.8,83 | 24.8,83 v24.8,82.1 | C12.2 26.5,84.7 24.8,83 | C2.2 32.8,50.25 | S1.1 7.15,53.55 v7.1,53.6 | U2.12 46,45.38 45.32,45.38 44.4,46.3 43,46.3 v42.6,45.9 | U1.19 47.35,70.65 v46.3,69.6 | U1.16 45.85,70.05 v46.3,69.6 | U1.14 44.85,71.05 v46.3,69.6 | U2.63 48.55,55.65 v47.3,56.9 | C4.1 64.25,51.4 v65.6,51.4 | 33.15,49.9 32.8,50.25 | R30.2 48.05,65.55 v48.8,66.3 49.55,67.05 C5.2 50.55,69.4 C6.2 | C18.2 45.65,65.15 v44.1,66.7 | C16.2 63.2,55.85 v63.2,55.9 | R31.1 35.3,30 v36.7,31.4 | D5.C v6.6,13.3 | C8.2 C7.2 63.5,75.55 v63.5,75.4 | C17.2 59.55,35.35 v59.6,35.3 | 37.25,54 C13.2 | C13.2 C14.2 | U2.18 48.55,37.9 C19.2 v49.3,35.4 | C3.1 54.5,37 v55.5,36 | C13.2 36.55,54.9 v35.6,54.9 | 32.8,50.25 32.8,51 v32,51.8 | C1.2 32.45,47 v30.8,47
  Bottom 0.152: 26.67,9.47 26.7,9.5 | 36.96,9.46 37,9.5
  Bottom 1.016: v26.67,7.62 26.67,9.47 | v36.96,7.62 36.96,9.46
  pour Top (no thermals): 23.5,7.62 24.13,8.26 29.21,8.26 29.84,7.62 29.84,1.91 23.5,1.91
  pour Bottom (no thermals): 23.5,7.62 24.13,8.26 29.21,8.26 29.84,7.62 29.84,1.91 23.5,1.91
  pour Top (no thermals): 33.66,1.78 40.13,1.78 40.13,7.62 39.62,8.26 34.04,8.26 33.53,7.62 33.53,1.91
  pour Bottom (no thermals): 33.53,7.62 33.53,1.91 33.66,1.78 40.01,1.78 40.01,4.06 40.01,5.71 40.13,5.84 40.13,7.62 39.62,8.26 34.04,8.26
  pour Bottom: -11.8,106.8 -11.8,18.3 -2.2,8.7 47.7,8.7 55.1,16.1 55.1,19.4 56.4,20.7 88.2,20.7 89.9,22.4 89.9,32.2 92.7,35 113.1,35 112.9,109 -9.6,109
JETS_CNTRL  (via drill 0.35)
  Top 0.152: v48.6,11.7 48.4,11.9 v48.4,16.2 | v48.4,19.8 47.3,20.9 47.3,45.5 47.05,45.75 U2.11
  Bottom 0.152: v48.4,16.2 v48.4,19.8 | U$1.18 59.81,5.89 56.6,9.1 53.9,9.1 51.5,11.5 48.8,11.5 v48.6,11.7
LED_BLUE  (via drill 0.35)
  Top 0.152: R17.1 64.7,95.9 70.7,89.9 70.7,72.1 68.9,70.3 63.66,65.3 54.7,65.3 52.8,63.4 v52.8,63.2 | v52.8,60.3 52.8,54.1 52.18,53.48 52.18,52.8 U2.56
  Bottom 0.152: v52.8,63.2 v52.8,60.3
LED_GREEN  (via drill 0.35)
  Top 0.152: v54.5,63.4 55.8,64.69 64.03,64.69 71.35,72.02 71.35,90.5 68.15,93.7 R16.1 | U2.50 54.92,52.8 54.92,60.98 v54.5,61.4
  Bottom 0.152: v54.5,63.4 v54.5,61.4
LED_RED  (via drill 0.35)
  Top 0.152: 72.96,74.8 72.96,89.86 77.55,94.45 R14.1 | 72.96,74.8 72.96,71.97 v64.4,63.41 v64.4,63.4 | v64.4,61.4 64.4,59.2 56,50.8 56,50 56.25,49.75 U2.46 | J2.3 73.28,74.8 72.96,74.8
  Bottom 0.152: v64.4,63.4 64.4,61.8 v64.4,61.4
LED_YELLOW  (via drill 0.35)
  Top 0.152: v56.1,63.4 56.99,64.29 64.25,64.29 72.06,72.09 72.06,91.06 72.85,91.85 v72.85,92.4 R15.1 | v56.1,61.4 56.1,53.22 U2.49 | J2.2 74.7,83.56 v74.7,90.4
  Bottom 0.152: v56.1,63.4 v56.1,61.4 | v74.7,90.4 74.7,90.55 v72.85,92.4
MOBO_CNTRL  (via drill 0.35)
  Top 0.152: v53.5,10.7 53.5,16.2 v53.2,16.5 | v50.2,19.5 47.6,22.09 47.6,44.1 47.6,45.63 47.18,46.05 47.15,46.05 46.95,46.25 U2.10
  Bottom 0.152: 62.7,2.8 62.35,3.15 U$1.19 62.35,5.65 57.9,10.1 54.1,10.1 v53.5,10.7 | v53.2,16.5 v50.2,19.5
N$1
  Top 0.152: U2.6 40.79,48.25 Y1.1 36.41,44.85 C1.1
N$2
  Top 0.152: R11.1 87.7,87.65 J1.ID
N$3
  Top 0.152: D1.A 75.82,95.93 R14.2
N$4
  Top 0.152: R12.1 J1.D+
N$5
  Top 0.152: R13.1 89.3,83.75 J1.D-
N$6
  Top 0.152: D2.A 71.12,95.93 R15.2
N$7
  Top 0.152: D3.A 66.42,95.93 R16.2
N$8
  Top 0.152: D4.A 61.72,95.93 R17.2
N$9
  Top 0.152: U2.5 37.59,48.75 36.97,49.37 | 36.97,49.37 Y1.2 | C2.1 36.15,48.55 36.97,49.37
N$10
  Top 0.152: U2.47 61.4,50.25 C4.2
N$11
  Top 0.152: U2.31 55.05,40 C3.2
N$12
  Top 0.152: U1.20 C5.1
N$13
  Top 0.152: U1.22 C6.1
N$14
  Top 0.152: R21.2 38.55,75.7 42.87,75.7 U1.10
N$15
  Top 0.152: U2.4 43.8,49.25 41.98,51.08 Y3.P$1 39.15,53.9 C13.1
N$16
  Top 0.152: P1.R2 17.39,87.74 R25.1 24.45,92 30.5,92 42.35,80.15 U1.1
N$17
  Top 0.152: P1.R1 14.85,85.75 16.49,84.11 18.21,84.11 23.05,88.95 | 23.05,88.95 R26.1 | 23.05,88.95 32.95,88.95 42.3,79.6 42.87,79.6 U1.2
N$18  (via drill 0.35)
  Top 0.152: C10.1 26.7,79.45 R29.2 29.45,78.5 v29.7,78.5 | U1.5 42.87,78.1 41,78.1 35.9,78.1 v35.4,78.6
  Bottom 0.152: v29.7,78.5 35.3,78.5 v35.4,78.6
N$19
  Top 0.152: C11.1 36.33,77.58 | 36.33,77.58 36.4,77.65 U1.6 | 36.33,77.58 33.88,77.58 R28.2
N$20
  Top 0.152: P1.L2 3.6,74.7 10.7,67.6 25.95,67.6 R22.2
N$21
  Top 0.152: P1.L4 11.88,96.6 R23.2
N$22  (via drill 0.35)
  Top 0.152: R22.1 31,67.7 37.53,74.23 39.67,74.23 v39.7,74.2 | U1.27 48.51,75.65 47.85,76.31 45.91,76.31 v45.7,76.1
  Bottom 0.152: v39.7,74.2 43.8,74.2 v45.7,76.1
N$23  (via drill 0.35)
  Top 0.152: R23.1 27.6,96.6 v40.9,83.3 | U1.25 49.95,74.65 49.5,75.1 47.7,75.1 v47.4,75.4
  Bottom 0.152: v47.4,75.4 47.4,76.8 v40.9,83.3
N$24
  Top 0.152: R24.2 63.2,72.35 C8.1 59.01,72.35 Y2.2 54.21,77.15 U1.30
N$25  (1 unrouted)
  Top 0.152: R24.1 63.4,78.45 C7.1 62.09,78.24 Y2.1 57.56,77.6 51.33,77.6
N$26
  Top 0.152: P1.R8 23.7,71.25 C10.2
N$27
  Top 0.152: C11.2 30.65,70.2 22.3,70.2 14.85,77.65 P1.R7
N$28
  Top 0.152: C12.1 31.1,83.75 R28.1 R29.1
N$29
  Top 0.152: U2.3 45.05,49.75 44.3,50.5 44.3,51.25 Y3.P$2 C14.1
N$30
  Top 0.152: R30.1 49.75,58.18 49.92,58.01 49.92,52.8 U2.60
N$31
  Top 0.152: R32.2 4.45,15.03 D5.A
N$34
  Top 0.152: S1.3 9.79,42.9 13,42.9 14.15,42.9 | 14.15,42.9 37.2,42.9 42.05,47.75 U2.7 | 14.15,42.9 R27.1
PLTA_CNTRL  (via drill 0.35)
  Top 0.152: U2.9 46,46.62 42.46,46.62 40.4,44.56 v40.4,34 | v31.7,15.6 31.7,31.8 33.9,34 v37.9,34
  Bottom 0.152: v31.7,15.6 31.7,3.54 U$1.7 | v37.9,34 v40.4,34
PWM_3V3_CH1  (via drill 0.35)
  Top 0.152: U2.61 49.5,52.72 49.5,58 48.3,59.2 v47.2,59.2 | v26,41 26,23.3 28.1,21.2 v30.5,21.2 | v43.9,21 39.2,21 v39.1,21.1
  Bottom 0.152: Q1.2 57.65,20.62 57.08,21.2 44.09,21.2 v43.9,21 | v47.2,59.2 29.47,59.2 26,55.73 v26,41 | v30.5,21.2 30.5,21.1 v39.1,21.1
PWM_3V3_CH2  (via drill 0.35)
  Top 0.152: U2.62 49.1,52.72 49.1,57.4 v48.2,58.3 | v27.6,41.5 27.6,23.9 28.8,22.7 v30.5,22.7 | v42.9,22.1 39.8,22.1 v39.2,22.7
  Bottom 0.152: Q2.2 58.17,22.1 v42.9,22.1 | v48.2,58.3 30.3,58.3 27.6,55.6 v27.6,41.5 | 30.5,22.6 v30.5,22.7 v39.2,22.7
PWM_3V3_CH3  (via drill 0.35)
  Top 0.152: v66.3,20.7 66.3,30.1 76,39.8 76,41.51 73.28,44.22 57.5,44.22 U2.35
  Bottom 0.152: Q3.2 66.35,20.65 v66.3,20.7
PWM_3V3_CH4  (via drill 0.35)
  Top 0.152: v70.6,20.4 70.6,33.9 76.3,39.6 76.3,41.8 73.3,44.8 73.25,44.75 U2.36
  Bottom 0.152: Q4.2 70.65,20.35 v70.6,20.4
PWM_3V3_CH5  (via drill 0.35)
  Top 0.152: v45.6,22.9 41.9,26.6 41.9,43.3 42.85,44.25 U2.14
  Bottom 0.152: Q5.2 70.38,22.9 v45.6,22.9
PWM_3V3_CH6  (via drill 0.35)
  Top 0.152: v46.6,23.6 45.81,24.39 45.55,24.39 42.3,27.64 42.3,42.7 43.35,43.75 U2.15
  Bottom 0.152: Q6.2 73.97,23.6 v46.6,23.6
PWM_3V3_CH7  (via drill 0.35)
  Top 0.152: v45.8,25 42.8,28 42.8,42.5 43.55,43.25 U2.16
  Bottom 0.152: Q7.2 76.88,25 50.46,25 50.45,24.99 49.95,24.99 49.94,25 v45.8,25
PWM_3V3_CH8  (via drill 0.35)
  Top 0.152: v50.2,25.6 48.05,27.75 U2.17
  Bottom 0.152: Q8.2 87.57,18.32 80.3,25.6 v50.2,25.6
PWM_CH1
  Bottom 0.152: 64.89,6.17 U$1.20 64.89,8.59 Q1.3
PWM_CH2
  Bottom 0.152: Q2.3 67.42,10.35 U$1.21
PWM_CH3
  Bottom 0.152: Q3.3 69.97,12.21 U$1.22
PWM_CH4
  Bottom 0.152: Q4.3 72.5,13.97 U$1.23
PWM_CH5
  Bottom 0.152: Q5.3 75.05,15.73 U$1.24
PWM_CH6
  Bottom 0.152: U$1.25 77.58,15.46 Q6.3
PWM_CH7
  Bottom 0.152: U$1.26 80.13,8.63 82.9,11.4 Q7.3
PWM_CH8
  Bottom 0.152: U$1.27 82.8,3.51 82.8,8.2 87.2,12.6 Q8.3
ROBOT_SCL  (via drill 0.35)
  Top 0.152: v73.9,42.4 67.2,42.4 66.1,41.3 57.5,41.3 55.9,42.9 54.4,42.9 54.05,42.55 U2.29 | U$1.29 85.21,33.99 v76.8,42.4
  Bottom 0.152: v76.8,42.4 v73.9,42.4
ROBOT_SDA  (via drill 0.35)
  Top 0.152: U2.30 54.6,41.38 54.6,42.4 54.8,42.59 55.77,42.59 57.37,40.99 66.23,40.99 66.23,41 v75,41 | U$1.30 82.67,35.33 v77,41
  Bottom 0.152: v77,41 75.1,41 v75,41
SPI_MISO  (via drill 0.35)
  Top 0.152: U2.22 50.68,41.46 50.68,48.71 53.27,51.3 v53.4,51.3 | U1.34 53.25,79.15 58.8,84.7 63.1,84.7 68.7,79.1 68.7,73.2 61.69,66.19 v61.69,66 | v61.69,61.5 61.69,59.39 v58,55.7
  Bottom 0.152: v61.69,66 v61.69,61.5 | v58,55.7 53.6,51.3 v53.4,51.3
SPI_MOSI  (via drill 0.35)
  Top 0.152: U1.35 52.25,79.65 58.4,85.8 63.4,85.8 69.4,79.8 69.4,72.9 62.7,66.2 v62.7,66 | v54.7,51.3 51.05,47.65 U2.23 | v62.7,61.5 62.7,59.3 v58,54.6
  Bottom 0.152: v62.7,66 v62.7,61.5 | v58,54.6 v54.7,51.3
SPI_RESET  (via drill 0.35)
  Top 0.152: U1.37 49.72,81.45 49.72,80.7 49,79.99 v49,79.6 | v57.5,61.4 57.5,52.9 52.02,47.42 52.02,41.36 U2.25 | v52.8,72.6 57.6,67.8 v57.6,66
  Bottom 0.152: v49,79.6 49,76.4 v52.8,72.6 | v57.6,66 57.6,61.5 v57.5,61.4
SPI_SCK  (via drill 0.35)
  Top 0.152: v52.2,51.3 50.05,49.15 U2.21 | U1.33 51.41,78.78 54.21,78.78 59.03,83.6 62.6,83.6 68.2,78 68.2,73.5 v60.7,66 | v60.7,61.5 60.7,59.4 v58,56.7
  Bottom 0.152: v60.7,66 v60.7,61.5 | v52.2,51.3 57.6,56.7 v58,56.7
SPI_SS  (via drill 0.35)
  Top 0.152: v50.9,51.2 49.55,49.85 U2.20 | U1.32 55.05,78.15 59.5,82.6 62.4,82.6 67.7,77.3 67.7,73.9 59.8,66 v59.7,66 | v59.7,61.5 59.7,59.6 v58,57.9
  Bottom 0.152: v59.7,66 v59.7,61.5 | v58,57.9 57.6,57.9 v50.9,51.2
SW_1  (via drill 0.35)
  Top 0.152: U$1.38 62.35,39.15 v62.3,39.2 | v62.3,43.1 61.65,43.75 U2.34
  Bottom 0.152: v62.3,39.2 v62.3,43.1
SW_2  (via drill 0.35)
  Top 0.152: U$1.39 59.81,9.71 61.5,11.4 61.5,38.2 v61.3,38.4 | v61.3,45.4 61.2,45.5 59.1,45.5 58.8,45.2 57.52,45.2 U2.37
  Bottom 0.152: v61.3,38.4 v61.3,45.4
SW_3  (via drill 0.35)
  Top 0.152: U$1.40 57.27,8.57 60.8,12.1 v60.8,37.2 | U2.38 58.92,45.75 59.18,46.01 65.99,46.01 v66.3,45.7
  Bottom 0.152: v60.8,37.2 61.3,37.7 65,37.7 66.3,39 v66.3,45.7
SW_4
  Top 0.152: U$1.41 54.73,30.57 51.5,33.8 51.5,41.28 U2.24
SW_5  (via drill 0.35)
  Top 0.152: U$1.42 52.19,17.69 54,19.5 v54,29.9 | v54,34.4 54,35.9 53.05,36.85 U2.27
  Bottom 0.152: v54,29.9 v54,34.4
SW_KILL  (via drill 0.35)
  Top 0.152: 64.6,3.66 U$1.37 64.89,9.06 64.69,9.25 v64.69,39.09 v64.7,39.1 | v64.6,42.2 64.55,42.15 58.57,42.15 U2.33
  Bottom 0.152: v64.6,42.2 64.6,39.2 v64.7,39.1
USB_DN  (via drill 0.35)
  Top 0.152: v75.6,61.4 75.6,54.4 69.9,48.7 57.52,48.7 U2.44 | v85.7,67.5 93,74.8 R13.2 | v83.8,66.7 78.9,66.7 v75.6,63.4
  Bottom 0.152: v85.7,67.5 84.9,66.7 v83.8,66.7 | v75.6,63.4 v75.6,61.4
USB_DP  (via drill 0.35)
  Top 0.152: v74.4,61.4 74.4,53.9 69.6,49.1 58.3,49.1 58.28,49.12 57.6,49.12 U2.45 | v84.7,68.6 88.5,72.4 R12.2 | v82.6,68 79,68 v74.4,63.4
  Bottom 0.152: 84.6,68.5 v84.7,68.6 84.1,68 v82.6,68 | v74.4,63.4 v74.4,61.4
USB_ID
  Top 0.152: R11.2 82.5,78.05 R20.1

### Text on the board
tPlace: 3V3 | Coprocessor | The Underwater Robotics Team / Center for Automotive Research
tNames: RESET